# EAGLE schematic RAMPS_1-41 (EAGLE 6.3)
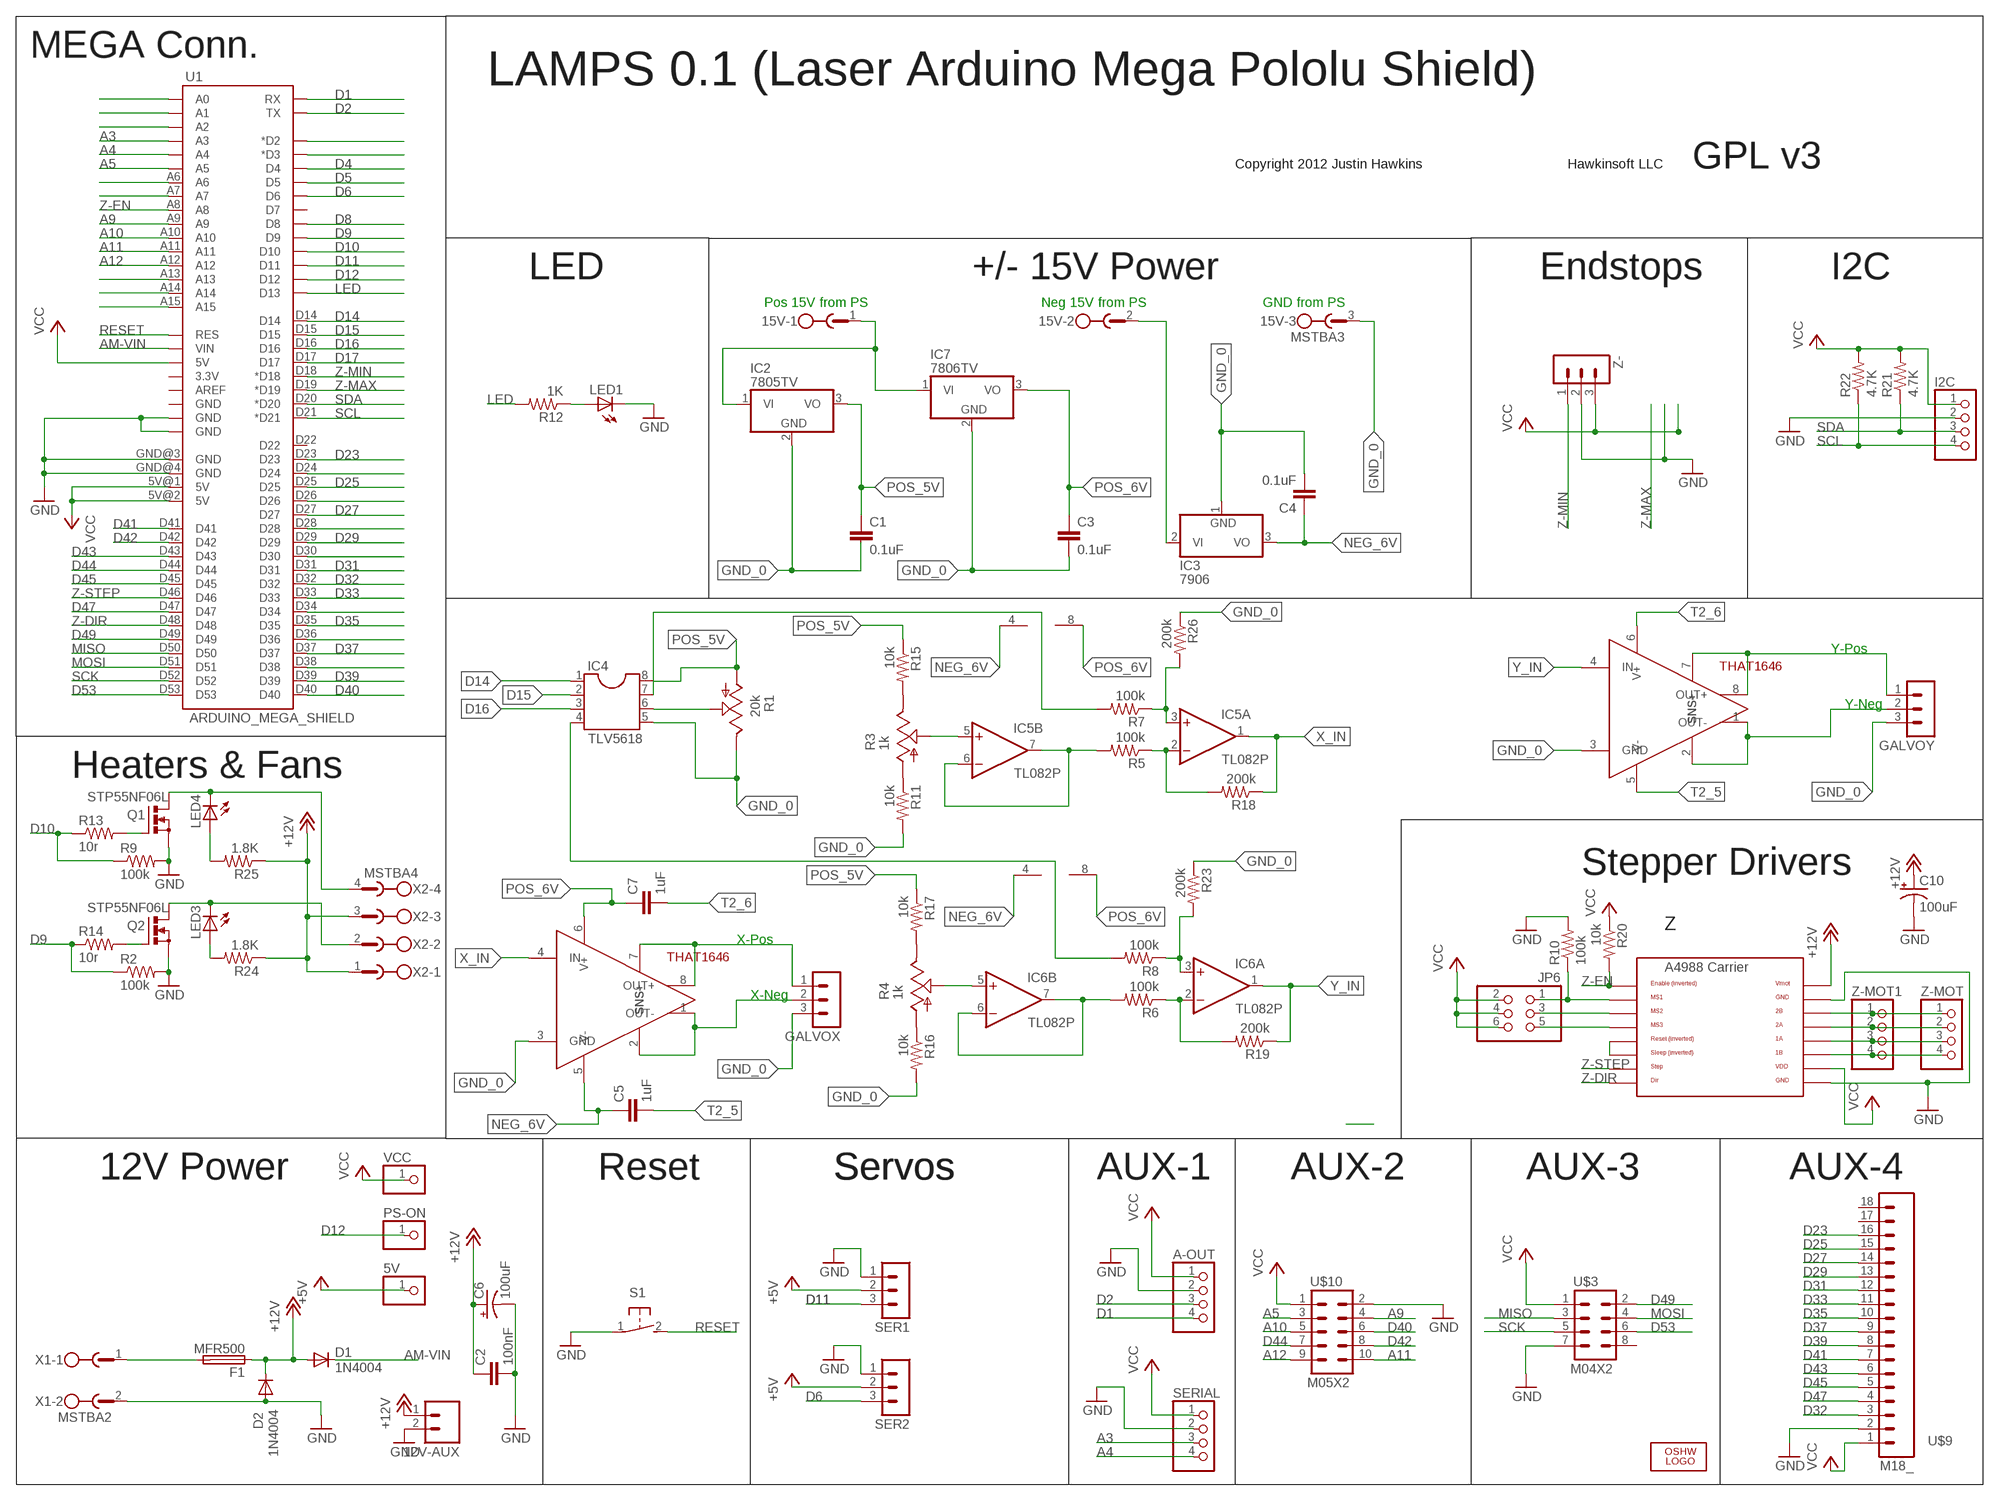
[diagram p0: schematic, sheet 1]

## Parts
5V  PINHD-1X1  [1X01]
12V-AUX  M02PTH  [1X02]
15V  MSTBA3  [MSTBA3]
A-OUT  PINHD-1X4  [1X04]
C1  0.1uF  C2.5/2  [C2.5-2]
C2  100nF  C-EUC0805  [C0805]
C3  0.1uF  C2.5/2  [C2.5-2]
C4  0.1uF  C2.5/2  [C2.5-2]
C5  1uF  C2.5/2  [C2.5-2]
C6  100uF  CPOL-US153CLV-0605  [153CLV-0605]
C7  1uF  C2.5/2  [C2.5-2]
C10  100uF  CPOL-US153CLV-0605  [153CLV-0605]
D1  1N4004  [DO41-10]
D2  1N4004  [DO41-10]
F1  MFR500  PTCFUSE  [MFR500]
GALVOX  3PIN-HEADER  [3PIN-HEADER]
GALVOY  3PIN-HEADER  [3PIN-HEADER]
I2C  PINHD-1X4  [1X04]
IC2  7805TV  [TO220V]
IC3  7906  7906T  [TO220H]
IC4  TLV5618  DIL8S  [SOCKET-08]
IC5  TL082P  [DIL08]
IC6  TL082P  [DIL08]
IC7  7806TV  7805TV  [TO220V]
JP6  PINHD-2X3  [2X03]
LED1  LEDCHIP-LED0805  [CHIP-LED0805]
LED3  LEDCHIP-LED0805  [CHIP-LED0805]
LED4  LEDCHIP-LED0805  [CHIP-LED0805]
LOGO1  OSHW_LOGO_6MILX0100-NT  [OSHW_6X100_NOTEXT]
PS-ON  PINHD-1X1  [1X01]
Q1  STP55NF06L  IRF512  [TO220BV]
Q2  STP55NF06L  IRF512  [TO220BV]
R1  20k  TRIM_US-B25P  [B25P]
R2  100k  R-US_R0805  [R0805]
R3  1k  TRIM_US-B25P  [B25P]
R4  1k  TRIM_US-B25P  [B25P]
R5  100k  R-US_R0805  [R0805]
R6  100k  R-US_R0805  [R0805]
R7  100k  R-US_R0805  [R0805]
R8  100k  R-US_R0805  [R0805]
R9  100k  R-US_R0805  [R0805]
R10  100k  R-US_R0805  [R0805]
R11  10k  R-US_R0805  [R0805]
R12  1K  R-US_R0805  [R0805]
R13  10r  R-US_R0805  [R0805]
R14  10r  R-US_M0805  [M0805]
R15  10k  R-US_R0805  [R0805]
R16  10k  R-US_R0805  [R0805]
R17  10k  R-US_R0805  [R0805]
R18  200k  R-US_R0805  [R0805]
R19  200k  R-US_R0805  [R0805]
R20  10k  R-US_R0805  [R0805]
R21  4.7K  R-US_R0805  [R0805]
R22  4.7K  R-US_R0805  [R0805]
R23  200k  R-US_R0805  [R0805]
R24  1.8K  R-US_R0805  [R0805]
R25  1.8K  R-US_R0805  [R0805]
R26  200k  R-US_R0805  [R0805]
S1  31-XX  [B3F-31XX]
SER1  3PIN-HEADER  [3PIN-HEADER]
SER2  3PIN-HEADER  [3PIN-HEADER]
SERIAL  PINHD-1X4  [1X04]
U1  ARDUINO_MEGA_SHIELD  [ARDUINO_MEGA_SHIELD]
U$1  THAT1646  [THAT1646]
U$3  M04X2  [2X4]
U$4  THAT1646  [THAT1646]
U$8  A4988BREAKOUT  [A4988BREAKOUT]
U$9  M18_  [1X18]
U$10  M05X2  [2X5]
VCC  PINHD-1X1  [1X01]
X1  MSTBA2  [MSTBA2]
X2  MSTBA4  [MSTBA4]
Z-  3PIN-HEADER  [3PIN-HEADER]
Z-MOT  PINHD-1X4  [1X04]
Z-MOT1  PINHD-1X4  [1X04]

## Nets
+5V: 5V.1 SER1.2 SER2.2
+12V: 12V-AUX.1 C2.1 C6.+ C10.+ D1.A D2.C F1.1 R24.1 R25.1 U$8.VMOT X2.1 X2.3
A3: SERIAL.3 U1.A3
A4: SERIAL.4 U1.A4
A5: U1.A5 U$10.3
A9: U1.A9 U$10.4
A10: U1.A10 U$10.5
A11: U1.A11 U$10.10
A12: U1.A12 U$10.9
AM-VIN: D1.C U1.VIN
D1: A-OUT.4 U1.RX
D2: A-OUT.3 U1.TX
D4: U1.D4
D5: U1.D5
D6: SER2.3 U1.D6
D8: U1.D8
D9: R2.1 R14.1 U1.D9
D10: R9.1 R13.1 U1.D10
D11: SER1.3 U1.D11
D12: PS-ON.1 U1.D12
D14: IC4.1 U1.D14
D15: IC4.2 U1.D15
D16: IC4.3 U1.D16
D17: U1.D17
D23: U1.D23 U$9.16
D25: U1.D25 U$9.15
D27: U1.D27 U$9.14
D29: U1.D29 U$9.13
D31: U1.D31 U$9.12
D32: U1.D32 U$9.3
D33: U1.D33 U$9.11
D35: U1.D35 U$9.10
D37: U1.D37 U$9.9
D39: U1.D39 U$9.8
D40: U1.D40 U$10.6
D41: U1.D41 U$9.7
D42: U1.D42 U$10.8
D43: U1.D43 U$9.6
D44: U1.D44 U$10.7
D45: U1.D45 U$9.5
D47: U1.D47 U$9.4
D49: U1.D49 U$3.2
D53: U1.D53 U$3.6
E0-DIR: U1.D28
E0-EN: U1.D24
E0-STEP: U1.D26
E1-DIR: U1.D34
E1-EN: U1.D30
E1-STEP: U1.D36
GND: 12V-AUX.2 A-OUT.2 C2.2 C6.- C10.- D2.A I2C.2 LED1.C Q1.S Q2.S R2.2 R9.2 R10.2 S1.1(P) SER1.1 SER2.1 SERIAL.2 U1.GND@0(GND) U1.GND@1(GND) U1.GND@3(GND) U1.GND@4(GND) U$3.7 U$8.GND U$8.GND@0(GND) U$9.2 U$10.2 X1.2 Z-.2
GND_0: 15V.3 C1.2 C3.2 C4.2 GALVOX.3 GALVOY.3 IC2.2(GND) IC3.1(GND) IC4.5 IC7.2(GND) R1.E R11.2 R16.2 R23.1 R26.1 U$1.3(GND) U$4.3(GND)
LED: R12.2 U1.D13
MISO: U1.D50 U$3.3
MOSI: U1.D51 U$3.4
N$1: LED3.C Q2.D X2.2
N$2: 15V.1 IC2.1(VI) IC7.1(VI)
N$3: 15V.2 IC3.2(VI)
N$4: R4.A R16.1
N$5: R4.E R17.2
N$6: IC4.6 R1.S
N$7: LED4.C Q1.D X2.4
N$8: R3.A R11.1
N$9: R3.E R15.2
N$10: IC6.5(B:+IN) R4.S
N$11: IC5.5(B:+IN) R3.S
N$12: GALVOX.2 U$1.1(OUT-) U$1.2(SNS-)
N$13: GALVOX.1 U$1.7(SNS+) U$1.8(OUT+)
N$14: IC5.6(B:-IN) IC5.7(B:OUT) R5.2
N$15: IC5.2(A:-IN) R5.1 R18.2
N$16: IC4.7 R7.2
N$17: IC5.3(A:+IN) R7.1 R26.2
N$18: IC6.6(B:-IN) IC6.7(B:OUT) R6.2
N$20: IC6.2(A:-IN) R6.1 R19.2
N$21: IC4.4 R8.2
N$22: IC6.3(A:+IN) R8.1 R23.2
N$24: GALVOY.2 U$4.1(OUT-) U$4.2(SNS-)
N$25: GALVOY.1 U$4.7(SNS+) U$4.8(OUT+)
N$37: JP6.3 U$8.MS2
N$38: U$8.RST U$8.SLP(SLEEP)
N$39: JP6.5 U$8.MS3
N$40: JP6.1 R10.1 U$8.MS1
N$41: U$8.2B Z-MOT1.1 Z-MOT.1
N$42: U$8.2A Z-MOT1.2 Z-MOT.2
N$43: U$8.1A Z-MOT1.3 Z-MOT.3
N$44: U$8.1B Z-MOT1.4 Z-MOT.4
N$45: LED3.A R24.2
N$46: LED1.A R12.1
N$47: Q2.G R14.2
N$48: Q1.G R13.2
N$50: LED4.A R25.2
N$54: F1.2 X1.1
NEG_6V: C4.1 C5.1 IC3.3(VO) IC5.4(P:V-) IC6.4(P:V-) U$1.5(V-)
POS_5V: C1.1 IC2.3(VO) IC4.8 R1.A R15.1 R17.1
POS_6V: C3.1 C7.1 IC5.8(P:V+) IC6.8(P:V+) IC7.3(VO) U$1.6(V+)
RESET: S1.2(S) U1.RES
SCK: U1.D52 U$3.5
SCL: I2C.4 R22.1 U1.D21(*D21)
SDA: I2C.3 R21.1 U1.D20(*D20)
T2_5: C5.2 U$4.5(V-)
T2_6: C7.2 U$4.6(V+)
THERM0: U1.A13
THERM1: U1.A14
THERM2: U1.A15
VCC: A-OUT.1 I2C.1 JP6.2 JP6.4 JP6.6 R20.1 R21.2 R22.2 SERIAL.1 U1.5V@0(5V) U1.5V@1(5V) U1.5V@2(5V) U$3.1 U$8.VDD U$9.1 U$10.1 VCC.1 Z-.3
X-DIR: U1.A1
X-EN: U1.D38
X-MAX: U1.D2(*D2)
X-MIN: U1.D3(*D3)
X-STEP: U1.A0
X_IN: IC5.1(A:OUT) R18.1 U$1.4(IN)
Y-DIR: U1.A7
Y-EN: U1.A2
Y-STEP: U1.A6
Y_IN: IC6.1(A:OUT) R19.1 U$4.4(IN)
Z-DIR: U1.D48 U$8.DIR
Z-EN: R20.2 U1.A8 U$8.EN
Z-MAX: U1.D19(*D19)
Z-MIN: U1.D18(*D18) Z-.1
Z-STEP: U1.D46 U$8.STEP
Unconnected: U1.3.3V U1.AREF U1.D7 U1.D22 U1.GND@2(GND) U$3.8 U$9.17 U$9.18

## Notes on the sheet
- MEGA Conn.
- LAMPS 0.1 (Laser Arduino Mega Pololu Shield)
- Copyright 2012 Justin Hawkins | Hawkinsoft LLC | GPL v3
- LED | +/- 15V Power | Endstops | I2C
- Pos 15V from PS | Neg 15V from PS | GND from PS
- Y-Pos
- Y-Neg
- Heaters & Fans
- Stepper Drivers
- Z
- X-Pos
- X-Neg
- 12V Power | Reset | Servos | Servos | AUX-1 | AUX-2 | AUX-3 | AUX-4

## Library data of the parts
5V PS-ON VCC = adafruit:PINHD-1X1: Pin header 1x1 for 0.1" spacing With round pins
12V-AUX = SparkFun:M02: Header 2 Standard 2-pin 0.1" header. Use with straight break away headers (SKU : PRT-00116), right angle break away headers (PRT-00553), swiss pins (PRT-00743), machine pins (PRT-00117), and female headers (PRT-00115). Molex polarized connector foot print use with SKU : PRT-08233 with associated crimp pins and housings.
15V = con-phoenix-508:MSTBA3: PHOENIX; MF: FARNELL; MPN: 1757255; OC_FARNELL: 3705183; OC_NEWARK: 71C4162
A-OUT I2C SERIAL Z-MOT Z-MOT1 = RepRapjr:PINHD-1X4: PIN HEADER
C1 C3-C5 C7 = capacitor-wima:C: CAPACITOR naming: grid - package width
C2 = resistor:C-EU: CAPACITOR, European symbol
C6 C10 = adafruit:CPOL-US: POLARIZED CAPACITOR, American symbol
D1 D2 = diode:1N4004: DIODE general purpose rectifier, 1 A
F1 = RepRapjr:PTCFUSE: LITTLEFUSE Picofuse/slow Littlefuse
GALVOX GALVOY SER1 SER2 Z- = ultimachine:3PIN-HEADER: PIN HEADER
IC2 IC7 = linear:78*: Positive VOLTAGE REGULATOR Source: http://cache.national.com/ds/LM/LM78L05.pdf http://www.fairchildsemi.com/ds/LM/LM7805.pdf
IC3 = linear:79*: Negative VOLTAGE REGULATOR
IC4 = ic-package:DIL8: Dual In Line / Socket
IC5 IC6 = linear:TL082: OP AMP
JP6 = pinhead:PINHD-2X3: PIN HEADER
LED1 LED3 LED4 = led:LED: LED OSRAM: - CHIPLED LG R971, LG N971, LY N971, LG Q971, LY Q971, LO R971, LY R971 LH N974, LH R974 LS Q976, LO Q976, LY Q976 LO Q996 - Hyper CHIPLED LW Q18S LB Q993, LB Q99A, LB R99A - SideLED LS A670, LO A670, LY A670, LG A670, LP A670 LB A673, LV A673, LT A673, LW A673 LH A674 LY A675 LS A676, LA A676, LO A676, LY A676, LW A676 LS A679, LY A679, LG A679 - Hyper Micro SIDELED® LS Y876, LA Y876, LO Y876, LY Y876 LT Y87S - SmartLED LW L88C, LW L88S LB L89C, LB L89S, LG L890 LS L89K, LO L89K, LY L89K LS L896, LA L896, LO L896, LY L896 - TOPLED LS T670, LO T670, LY T670, LG T670, LP T670 LSG T670, LSP T670, LSY T670, LOP T670, LYG T670 LG T671, LOG T671, LSG T671 LB T673, LV T673, LT T673, LW T673 LH T674 LS T676, LA T676, LO T676, LY T676, LB T676, LH T676, LSB T676, LW T676 LB T67C, LV T67C, LT T67C, LS T67K, LO T67K, LY T67K, LW E67C LS E67B, LA E67B, LO E67B, LY E67B, LB E67C, LV E67C, LT E67C LW T67C LS T679, LY T679, LG T679 LS T770, LO T770, LY T770, LG T770, LP T770 LB T773, LV T773, LT T773, LW T773 LH T774 LS E675, LA E675, LY E675, LS T675 LS T776, LA T776, LO T776, LY T776, LB T776 LHGB T686 LT T68C, LB T68C - Hyper Mini TOPLED® LB M676 - Mini TOPLED Santana® LG M470 LS M47K, LO M47K, LY M47K Source: http://www.osram.convergy.de LUXEON: - LUMILED® LXK2-PW12-R00, LXK2-PW12-S00, LXK2-PW14-U00, LXK2-PW14-V00 LXK2-PM12-R00, LXK2-PM12-S00, LXK2-PM14-U00 LXK2-PE12-Q00, LXK2-PE12-R00, LXK2-PE12-S00, LXK2-PE14-T00, LXK2-PE14-U00 LXK2-PB12-K00, LXK2-PB12-L00, LXK2-PB12-M00, LXK2-PB14-N00, LXK2-PB14-P00, LXK2-PB14-Q00 LXK2-PR12-L00, LXK2-PR12-M00, LXK2-PR14-Q00, LXK2-PR14-R00 LXK2-PD12-Q00, LXK2-PD12-R00, LXK2-PD12-S00 LXK2-PH12-R00, LXK2-PH12-S00 LXK2-PL12-P00, LXK2-PL12-Q00, LXK2-PL12-R00 Source: www.luxeon.com KINGBRIGHT: KA-3528ASYC Source: www.kingbright.com
LOGO1 = OSHW:OSHW_LOGO_6MIL
Q1 Q2 = transistor-power:IRF512: N-CHANNEL MOS FET
R1 R3 R4 = pot:TRIM_US-: POTENTIOMETER
R2 R5-R12 R15-R26 = adafruit:R-US_: RESISTOR, American symbol
R13 R14 = resistor:R-US_: RESISTOR, American symbol
S1 = switch-omron:31-XX: OMRON SWITCH; MPN: B3F-3100; OC_FARNELL: 959704; OC_NEWARK: 36M3582
U1 = RepRapjr:ARDUINO_MEGA_SHIELD
U$1 U$4 = THAT1646:THAT1646: THAT 1646 Balanced Line Driver (DIP) Datasheet: http://www.thatcorp.com/datashts/THAT_1606-1646_Datasheet.pdf
U$3 = SparkFun:M04X2
U$8 = RepRapjr:A4988BREAKOUT
U$9 = SparkFun:M18
U$10 = RepRapjr:M05X2
X1 = con-phoenix-508:MSTBA2: PHOENIX; MF: FARNELL; MPN: 1757242; OC_FARNELL: 3705171; OC_NEWARK: 71C4161
X2 = con-phoenix-508:MSTBA4: PHOENIX; MF: FARNELL; MPN: 1757268; OC_FARNELL: 3705195; OC_NEWARK: 71C4163